# EAGLE design cc (EAGLE 7.5.0)
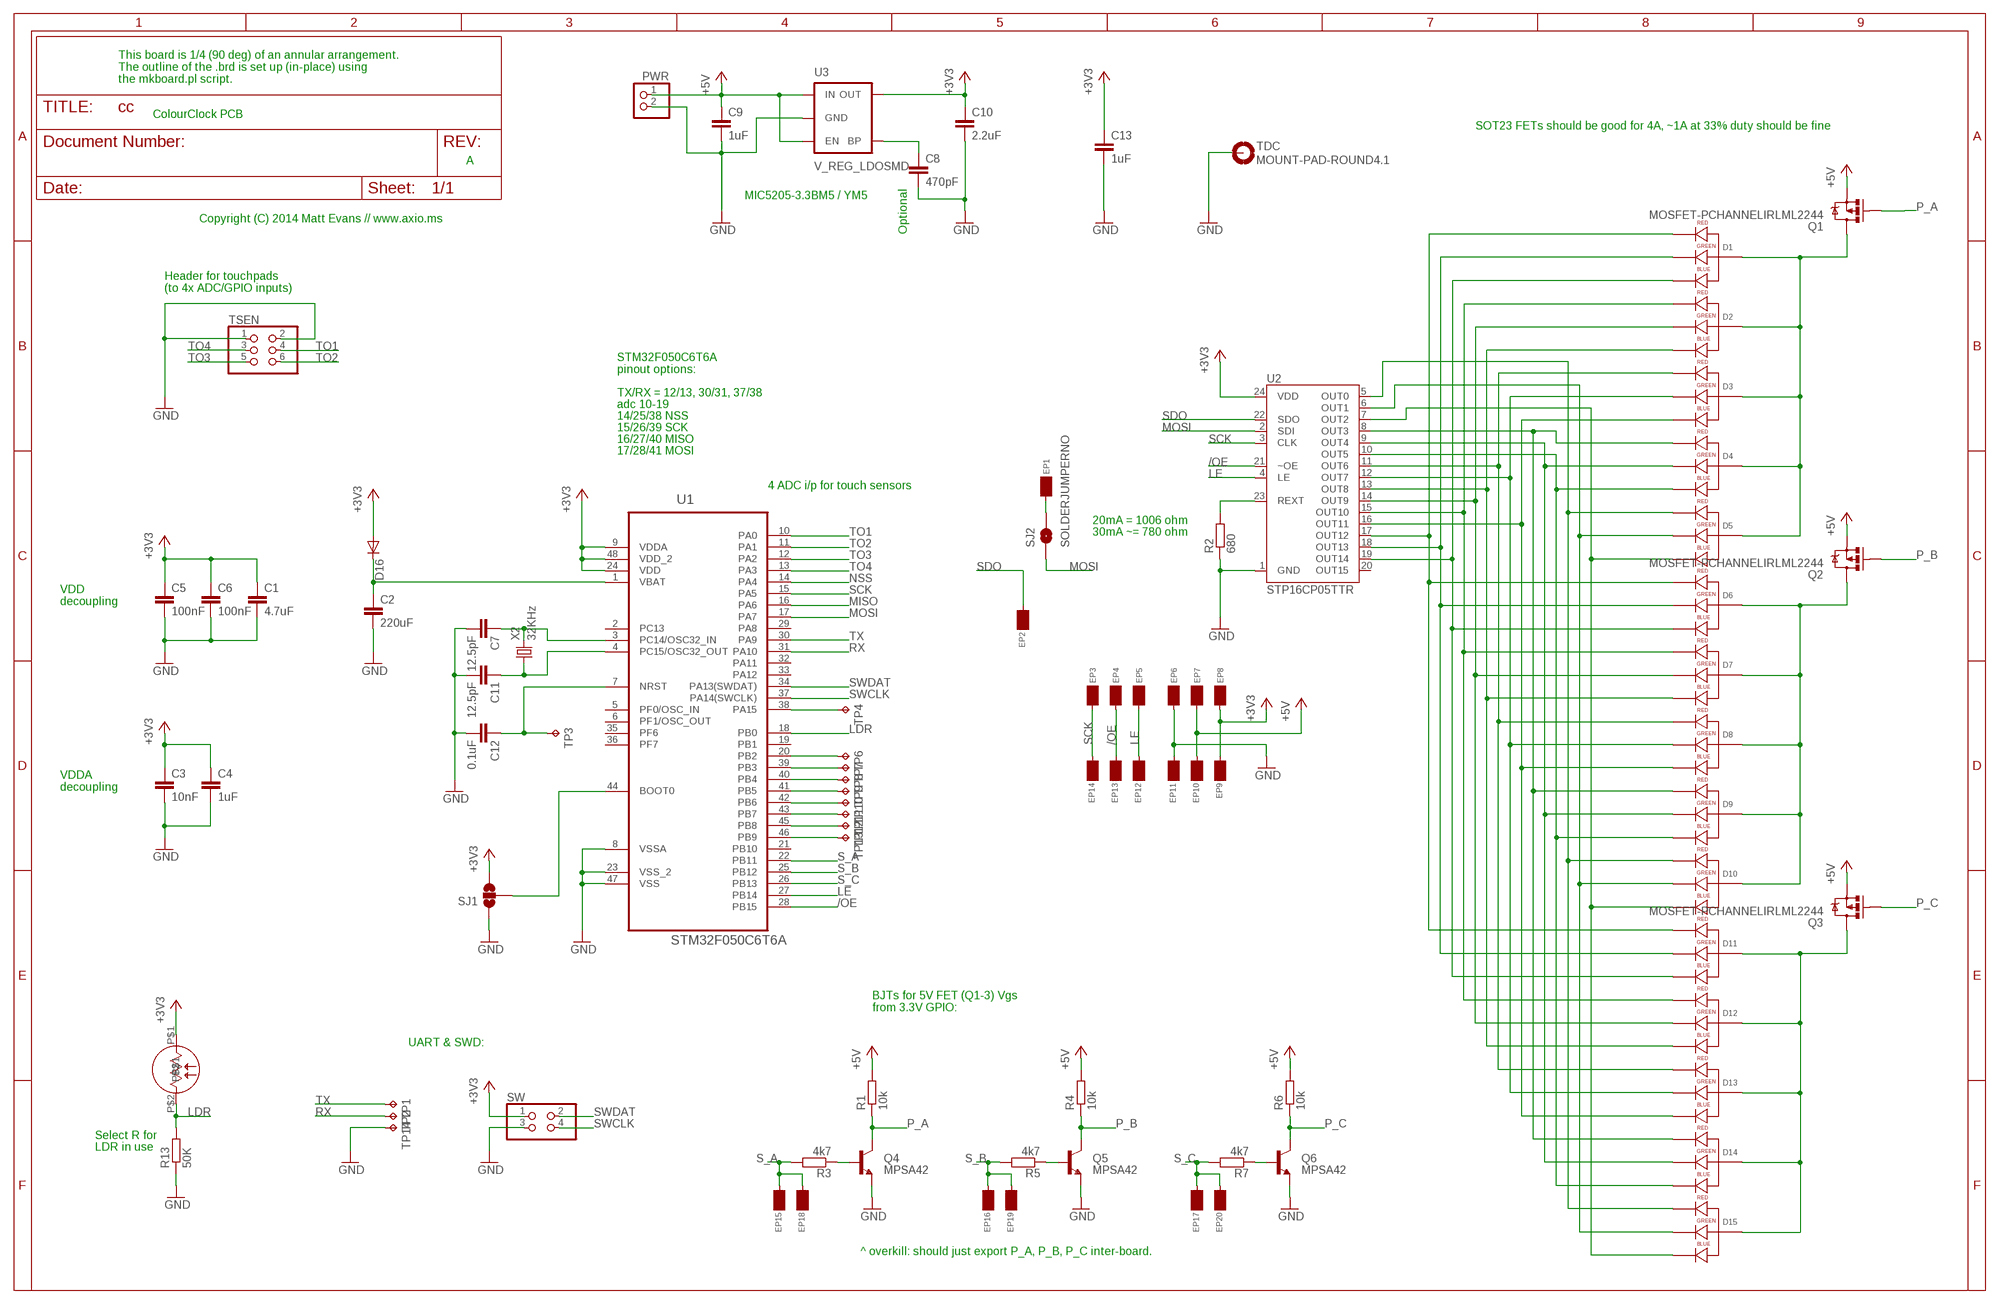
[diagram p0: schematic, sheet 1]

## Parts
C1  4.7uF  C-EUC0603  [C0603]
C2  220uF  C-EUC1210K  [C1210K]
C3  10nF  C-EUC0603  [C0603]
C4  1uF  C-EUC0603  [C0603]
C5  100nF  C-EUC0603  [C0603]
C6  100nF  C-EUC0603  [C0603]
C7  12.5pF  C-EUC1005  [C1005]
C8  470pF  C-EUC0603  [C0603]
C9  1uF  C-EUC0603  [C0603]
C10  2.2uF  C-EUC0603  [C0603]
C11  12.5pF  C-EUC1005  [C1005]
C12  0.1uF  C-EUC1005  [C1005]
C13  1uF  C-EUC0603  [C0603]
D1  LED-RGB-CA-THRUDIFFUSE  [LED-RGB-THRU]
D2  LED-RGB-CA-THRUDIFFUSE  [LED-RGB-THRU]
D3  LED-RGB-CA-THRUDIFFUSE  [LED-RGB-THRU]
D4  LED-RGB-CA-THRUDIFFUSE  [LED-RGB-THRU]
D5  LED-RGB-CA-THRUDIFFUSE  [LED-RGB-THRU]
D6  LED-RGB-CA-THRUDIFFUSE  [LED-RGB-THRU]
D7  LED-RGB-CA-THRUDIFFUSE  [LED-RGB-THRU]
D8  LED-RGB-CA-THRUDIFFUSE  [LED-RGB-THRU]
D9  LED-RGB-CA-THRUDIFFUSE  [LED-RGB-THRU]
D10  LED-RGB-CA-THRUDIFFUSE  [LED-RGB-THRU]
D11  LED-RGB-CA-THRUDIFFUSE  [LED-RGB-THRU]
D12  LED-RGB-CA-THRUDIFFUSE  [LED-RGB-THRU]
D13  LED-RGB-CA-THRUDIFFUSE  [LED-RGB-THRU]
D14  LED-RGB-CA-THRUDIFFUSE  [LED-RGB-THRU]
D15  LED-RGB-CA-THRUDIFFUSE  [LED-RGB-THRU]
D16  DIODESOD  [SOD-323]
EP1  EDGEPAD  [EDGEPAD]
EP2  EDGEPAD  [EDGEPAD]
EP3  EDGEPAD  [EDGEPAD]
EP4  EDGEPAD  [EDGEPAD]
EP5  EDGEPAD  [EDGEPAD]
EP6  EDGEPAD  [EDGEPAD]
EP7  EDGEPAD  [EDGEPAD]
EP8  EDGEPAD  [EDGEPAD]
EP9  EDGEPAD  [EDGEPAD]
EP10  EDGEPAD  [EDGEPAD]
EP11  EDGEPAD  [EDGEPAD]
EP12  EDGEPAD  [EDGEPAD]
EP13  EDGEPAD  [EDGEPAD]
EP14  EDGEPAD  [EDGEPAD]
EP15  EDGEPAD  [EDGEPAD]
EP16  EDGEPAD  [EDGEPAD]
EP17  EDGEPAD  [EDGEPAD]
EP18  EDGEPAD  [EDGEPAD]
EP19  EDGEPAD  [EDGEPAD]
EP20  EDGEPAD  [EDGEPAD]
LDR  VT935G  [VT935G]
PWR  PINHD-1X22MM  [1X02-2MM]
Q1  MOSFET-PCHANNELIRLML2244  [SOT23-3]
Q2  MOSFET-PCHANNELIRLML2244  [SOT23-3]
Q3  MOSFET-PCHANNELIRLML2244  [SOT23-3]
Q4  MPSA42  TRANSISTOR_NPNSOT23-3  [SOT23-3]
Q5  MPSA42  TRANSISTOR_NPNSOT23-3  [SOT23-3]
Q6  MPSA42  TRANSISTOR_NPNSOT23-3  [SOT23-3]
R1  10k  R-EU_R0603  [R0603]
R2  680  R-EU_R0603  [R0603]
R3  4k7  R-EU_R0603  [R0603]
R4  10k  R-EU_R0603  [R0603]
R5  4k7  R-EU_R0603  [R0603]
R6  10k  R-EU_R0603  [R0603]
R7  4k7  R-EU_R0603  [R0603]
R13  50K  R-EU_R0603  [R0603]
SJ1  SOLDERJUMPER_2WAYS  [SJ_3]
SJ2  SOLDERJUMPERNO  [SJ_2S-NO]
SW  PINHD-2X22MM  [2X02-2MM]
TDC  MOUNT-PAD-ROUND4.1  [4,1-PAD]
TP1  TPTP06R  [TP06R]
TP2  TPTP06R  [TP06R]
TP3  TPTP06R  [TP06R]
TP4  TPTP06R  [TP06R]
TP6  TPTP06R  [TP06R]
TP7  TPTP06R  [TP06R]
TP8  TPTP06R  [TP06R]
TP9  TPTP06R  [TP06R]
TP10  TPTP06R  [TP06R]
TP11  TPTP06R  [TP06R]
TP12  TPTP06R  [TP06R]
TP13  TPTP06R  [TP06R]
TP14  TPTP06R  [TP06R]
TSEN  PINHD-2X32MM  [2X03-2MM]
U1  STM32F050C6T6A  [QFP50P900X900X160-48N]
U2  STP16CP05TTR  [TSSOP24]
U3  V_REG_LDOSMD  [SOT23-5]
X2  32KHz  CRYTALTC26V  [TC26V]

## Nets
+3V3: C1.1 C3.1 C4.1 C5.1 C6.1 C10.1 C13.1 D16.2(A) EP8.1(P) EP9.1(P) LDR.P$1 SJ1.3 SW.1 U1.9(VDDA) U1.24(VDD) U1.48(VDD_2) U2.24(VDD) U3.5(OUT)
+5V: C9.1 EP7.1(P) EP10.1(P) PWR.1 Q1.2(S) Q2.2(S) Q3.2(S) R1.2 R4.2 R6.2 U3.1(IN) U3.3(EN)
/OE: EP4.1(P) EP13.1(P) U1.28(PB15) U2.21(~OE)
GND: C1.2 C2.2 C3.2 C4.2 C5.2 C6.2 C7.2 C8.2 C9.2 C10.2 C11.2 C12.2 C13.2 EP6.1(P) EP11.1(P) PWR.2 Q4.2(E) Q5.2(E) Q6.2(E) R2.1 R13.1 SJ1.1 SW.3 TDC.B4,1(MOUNT) TP14.TP TSEN.1 TSEN.2 U1.8(VSSA) U1.23(VSS_2) U1.47(VSS) U2.1(GND) U3.2(GND)
LDR: LDR.P$2 R13.2 U1.18(PB0)
LE: EP5.1(P) EP12.1(P) U1.27(PB14) U2.4(LE)
MISO: U1.16(PA6)
MOSI: SJ2.1 U1.17(PA7) U2.2(SDI)
N$1: D1.1(RED_CATHODE) D6.1(RED_CATHODE) D11.1(RED_CATHODE) U2.17(OUT12)
N$2: D1.3(GREEN_CATHODE) D6.3(GREEN_CATHODE) D11.3(GREEN_CATHODE) U2.18(OUT13)
N$3: D1.4(BLUE_CATHODE) D6.4(BLUE_CATHODE) D11.4(BLUE_CATHODE) U2.19(OUT14)
N$4: D2.1(RED_CATHODE) D7.1(RED_CATHODE) D12.1(RED_CATHODE) U2.15(OUT10)
N$5: D2.3(GREEN_CATHODE) D7.3(GREEN_CATHODE) D12.3(GREEN_CATHODE) U2.14(OUT9)
N$6: D2.4(BLUE_CATHODE) D7.4(BLUE_CATHODE) D12.4(BLUE_CATHODE) U2.13(OUT8)
N$7: D3.1(RED_CATHODE) D8.1(RED_CATHODE) D13.1(RED_CATHODE) U2.11(OUT6)
N$8: D3.3(GREEN_CATHODE) D8.3(GREEN_CATHODE) D13.3(GREEN_CATHODE) U2.12(OUT7)
N$9: D3.4(BLUE_CATHODE) D8.4(BLUE_CATHODE) D13.4(BLUE_CATHODE) U2.16(OUT11)
N$10: D4.1(RED_CATHODE) D9.1(RED_CATHODE) D14.1(RED_CATHODE) U2.8(OUT3)
N$11: D4.3(GREEN_CATHODE) D9.3(GREEN_CATHODE) D14.3(GREEN_CATHODE) U2.9(OUT4)
N$12: D4.4(BLUE_CATHODE) D9.4(BLUE_CATHODE) D14.4(BLUE_CATHODE) U2.10(OUT5)
N$13: D5.1(RED_CATHODE) D10.1(RED_CATHODE) D15.1(RED_CATHODE) U2.5(OUT0)
N$14: D5.3(GREEN_CATHODE) D10.3(GREEN_CATHODE) D15.3(GREEN_CATHODE) U2.6(OUT1)
N$15: D5.4(BLUE_CATHODE) D10.4(BLUE_CATHODE) D15.4(BLUE_CATHODE) U2.7(OUT2)
N$16: C7.1 U1.3(PC14/OSC32_IN) X2.2
N$17: C11.1 U1.4(PC15/OSC32_OUT) X2.1
N$18: R2.2 U2.23(REXT)
N$19: C2.1 D16.1(C) U1.1(VBAT)
N$20: TP8.TP U1.40(PB4)
N$21: TP7.TP U1.39(PB3)
N$22: EP1.1(P) SJ2.2
N$23: TP6.TP U1.20(PB2)
N$24: Q5.1(B) R5.1
N$25: C12.1 TP3.TP U1.7(NRST)
N$26: Q4.1(B) R3.1
N$27: D11.2(ANODE) D12.2(ANODE) D13.2(ANODE) D14.2(ANODE) D15.2(ANODE) Q3.3(D)
N$28: D6.2(ANODE) D7.2(ANODE) D8.2(ANODE) D9.2(ANODE) D10.2(ANODE) Q2.3(D)
N$29: D1.2(ANODE) D2.2(ANODE) D3.2(ANODE) D4.2(ANODE) D5.2(ANODE) Q1.3(D)
N$30: C8.1 U3.4(BP)
N$31: TP4.TP U1.38(PA15)
N$33: SJ1.2 U1.44(BOOT0)
N$34: Q6.1(B) R7.1
N$40: TP9.TP U1.41(PB5)
N$41: TP10.TP U1.42(PB6)
N$42: TP11.TP U1.43(PB7)
N$43: TP12.TP U1.45(PB8)
N$44: TP13.TP U1.46(PB9)
NSS: U1.14(PA4)
P_A: Q1.1(G) Q4.3(C) R1.1
P_B: Q2.1(G) Q5.3(C) R4.1
P_C: Q3.1(G) Q6.3(C) R6.1
RX: TP2.TP U1.31(PA10)
S_A: EP15.1(P) EP18.1(P) R3.2 U1.22(PB11)
S_B: EP16.1(P) EP19.1(P) R5.2 U1.25(PB12)
S_C: EP17.1(P) EP20.1(P) R7.2 U1.26(PB13)
SCK: EP3.1(P) EP14.1(P) U1.15(PA5) U2.3(CLK)
SDO: EP2.1(P) U2.22(SDO)
SWCLK: SW.4 U1.37(PA14(SWCLK))
SWDAT: SW.2 U1.34(PA13(SWDAT))
TO1: TSEN.4 U1.10(PA0)
TO2: TSEN.6 U1.11(PA1)
TO3: TSEN.5 U1.12(PA2)
TO4: TSEN.3 U1.13(PA3)
TX: TP1.TP U1.30(PA9)
Unconnected: U1.2(PC13) U1.5(PF0/OSC_IN) U1.6(PF1/OSC_OUT) U1.19(PB1) U1.21(PB10) U1.29(PA8) U1.32(PA11) U1.33(PA12) U1.35(PF6) U1.36(PF7) U2.20(OUT15)

## Notes on the sheet
- This board is 1/4 (90 deg) of an annular arrangement.
  The outline of the .brd is set up (in-place) using
  the mkboard.pl script.
- ColourClock PCB
- SOT23 FETs should be good for 4A, ~1A at 33% duty should be fine
- A
- MIC5205-3.3BM5 / YM5
- Copyright (C) 2014 Matt Evans // www.axio.ms
- Optional
- Header for touchpads
  (to 4x ADC/GPIO inputs)
- STM32F050C6T6A
  pinout options:
- TX/RX = 12/13, 30/31, 37/38
- adc 10-19
- 14/25/38 NSS
- 15/26/39 SCK
- 16/27/40 MISO
- 17/28/41 MOSI
- 4 ADC i/p for touch sensors
- 20mA = 1006 ohm
- 30mA ~= 780 ohm
- VDD
  decoupling
- VDDA
  decoupling
- BJTs for 5V FET (Q1-3) Vgs
  from 3.3V GPIO:
- UART & SWD:
- Select R for
- LDR in use
- ^ overkill: should just export P_A, P_B, P_C inter-board.

## Library data of the parts
C1-C13 = rcl:C-EU: CAPACITOR, European symbol
D1-D15 = SparkFun-LED:LED-RGB-CA-THRU: RGB Through-hole common anode SparkFun store front COM-10821 (diffuse) COM-10820 (clear); PROD_ID: DIO-10632
D16 = SparkFun-DiscreteSemi:DIODE: Diode These are standard reverse protection diodes and small signal diodes. SMA package can handle up to about 1A. SOD-323 can handle about 200mA. What the SOD-323 package when ordering, there are some mfgs out there that are 5-pin packages.; PROD_ID: DIO-09646
EP1-EP20 = matt:EDGEPAD: Board edge pad
LDR = matt:VT935G: VT935G LDR Light-dependent resistor 10Mohm dark, 48-118Kohm at 10 Lux
PWR = matt:PINHD-1X2: PIN HEADER
Q1-Q3 = SparkFun-DiscreteSemi:MOSFET-PCHANNEL: Generic PMOSFET; PROD_ID: TRANS-11153
Q4-Q6 = SparkFun-DiscreteSemi:TRANSISTOR_NPN: Generic NPN BJT MMBT2222A - TRANS-08049 (SOT-23, 1A 40V) MPSA42 - TRANS-09116 (SOT-23, 500mA 300V) MMBT5088LT1G - TRANS-11160 (SOT-23, 50 mA 30V)
R1 R3-R7 R13 = rcl:R-EU_: RESISTOR, European symbol
R2 = resistor:R-EU_: RESISTOR, European symbol
SJ1 = SparkFun-Passives:SOLDERJUMPER_2WAY: Solder Jumper 2 way solder jumper
SJ2 = SparkFun-Passives:SOLDERJUMPER: Solder Jumper Standard SMD solder jumper. Used to automate production. Two varients : Normally Open and Normally Closed are the same, but have different paste layers. NC will have a large amount of paste and should jumper during reflow.
SW = matt:PINHD-2X2: PIN HEADER
TDC = holes:MOUNT-PAD-ROUND: MOUNTING PAD, round
TP1-TP4 TP6-TP14 = testpad:TP: Test pad
TSEN = matt:PINHD-2X3: PIN HEADER
U1 = e14-stm32f050:STM32F050C6T6A: MCU, 32BIT, ARM CORTEX-M0, 48LQFP; MPN: STM32F050C6T6A; OC_FARNELL: 2115059; OC_NEWARK: 90T0645; PACKAGE: 48LQFP; SUPPLIER: STMicroelectronics
U2 = matt:STP16CP05: 16-pin constant current sink shift register LED driver
U3 = SparkFun-PowerIC:V_REG_LDO: Voltage Regulator LDO Standard 150mA LDO voltage regulator in SOT-23 layout. Micrel part MIC5205. BP (by-pass) pin is used to lower output noise with 470pF cap.
X2 = crystal:CRYTAL: CRYSTAL

## Board
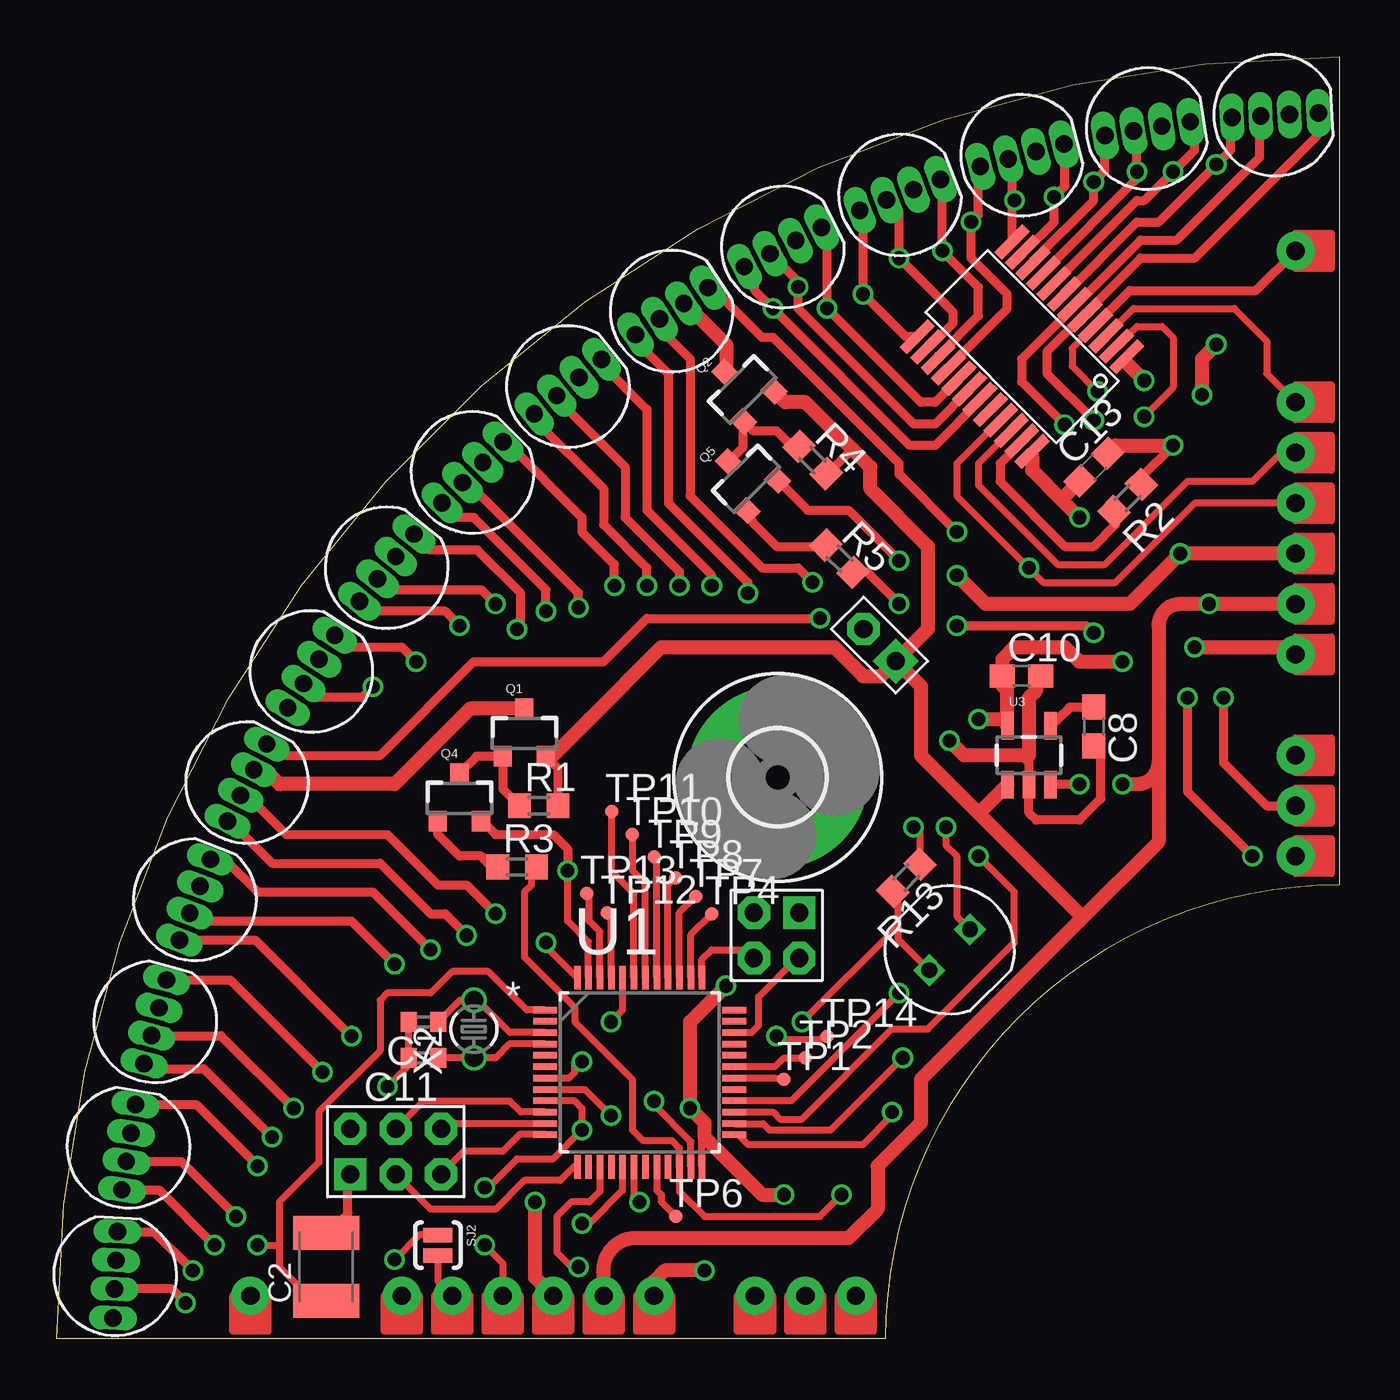
[diagram p1: board, top side]
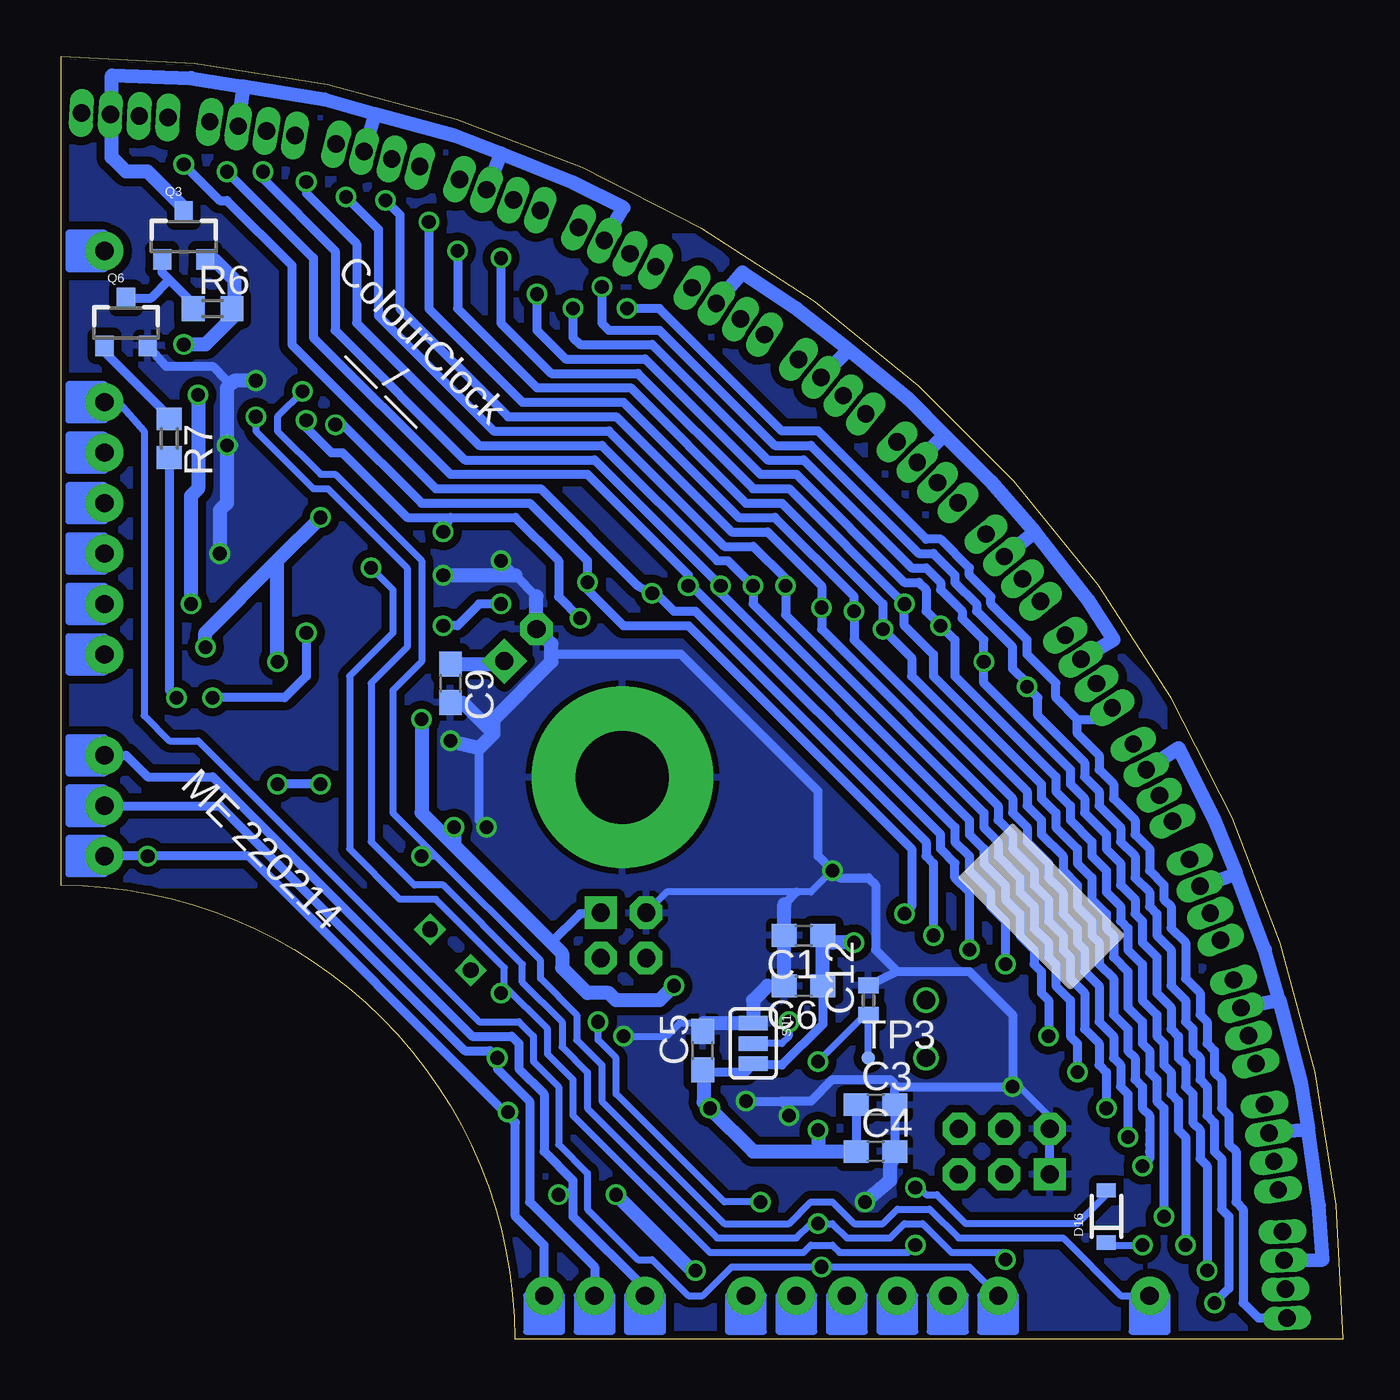
[diagram p2: board, bottom side, seen from below]

Size 56.5 x 56.5 mm. Coordinates in mm from the lower left corner, seen from the top.
Outline: 0,0 0.31,5.91 1.24,11.75 2.77,17.46 4.88,22.98 7.57,28.25 10.79,33.21 14.51,37.81 18.69,41.99 23.29,45.71 28.25,48.93 33.52,51.62 39.04,53.73 44.75,55.27 50.59,56.19 56.5,56.5 56.5,20 55.52,19.98 54.54,19.9 53.56,19.78 52.6,19.62 51.64,19.4 50.69,19.14 49.76,18.83 48.85,18.48 47.95,18.08 47.07,17.64 46.22,17.16 45.39,16.63 44.59,16.06 43.81,15.46 43.07,14.82 42.36,14.14 41.68,13.43 41.04,12.69 40.44,11.91 39.87,11.11 39.34,10.28 38.86,9.43 38.42,8.55 38.02,7.65 37.67,6.74 37.36,5.81 37.1,4.86 36.88,3.9 36.72,2.94 36.6,1.96 36.52,0.98 36.5,0 0,0
Copper layers (1*2*15*16): Top 0.035mm / dielectric 0.2mm / layer 2 0.0175mm / dielectric 1.1mm / layer 15 0.0175mm / dielectric 0.2mm / Bottom 0.035mm
Design rules "SeeedStudio_DRU_no_angle_20130527 *": minimum track width 6mil, minimum drill 12mil, track to track 6mil, track to pad 6mil, pad to pad 6mil, via to via 6mil, smd to smd 0mil, copper to edge 10mil, drill to drill 10mil, minimum pad ring 6mil, minimum via ring 6mil, stop-mask expansion 2mil, vias tented up to drill 25mil, thermal gap 10mil

### Footprints (pad centres in the part's own frame; a part is rotated, then mirrored left to right if it is on the bottom)
C0603 = smd 1.1 x 1: 1 -0.85,0; 2 0.85,0
C1210K = smd 1.5 x 2.9: 1 -1.5,0; 2 1.5,0
C1005 = smd 0.7 x 0.9: 1 -0.65,0; 2 0.65,0
LED-RGB-THRU = drill 0.762 pad 0.889 long: 1 1.905,0; 2 0.635,0; 3 -0.635,0; 4 -1.905,0
SOD-323 = smd 0.63 x 0.83: 1 -1.15,0; 2 1.15,0
EDGEPAD = drill 0.8 pad 1.676: 1 0,0
VT935G = drill 0.7 square: P$1 -1.27,0; P$2 1.27,0
1X02-2MM = drill 0.8 pad 1.422 square: 1 -1,0 | drill 0.8 pad 1.422 octagon: 2 1,0
SOT23-3 = smd 0.8 x 0.9: 1 -0.95,-1; 2 0.95,-1; 3 0,1.1
R0603 = smd 1 x 1.1: 1 -0.85,0; 2 0.85,0
SJ_3 = smd 0.635 x 1.27: 1 -0.889,0; 2 0,0; 3 0.889,0
SJ_2S-NO = smd 0.635 x 1.27: 1 -0.45,0; 2 0.45,0
2X02-2MM = drill 0.8 pad 1.422 square: 1 -1,1 | drill 0.8 pad 1.422 octagon: 2 1,1; 3 -1,-1; 4 1,-1
4,1-PAD = drill 4.1 pad 8: B4,1 0,0
TP06R = smd 0.6 x 0.6: TP 0,0
2X03-2MM = drill 0.8 pad 1.422 square: 1 -1,1 | drill 0.8 pad 1.422 octagon: 2 1,1; 3 -1,-1; 4 1,-1; 5 -1,-3; 6 1,-3
QFP50P900X900X160-48N = smd 1.041 x 0.279: 1 -4.166,2.743; 2 -4.166,2.261; 3 -4.166,1.753; 4 -4.166,1.245; 5 -4.166,0.762; 6 -4.166,0.254; 7 -4.166,-0.254; 8 -4.166,-0.762; 9 -4.166,-1.245; 10 -4.166,-1.753; 11 -4.166,-2.261; 12 -4.166,-2.743; 25 4.166,-2.743; 26 4.166,-2.261; 27 4.166,-1.753; 28 4.166,-1.245; 29 4.166,-0.762; 30 4.166,-0.254; 31 4.166,0.254; 32 4.166,0.762; 33 4.166,1.245; 34 4.166,1.753; 35 4.166,2.261; 36 4.166,2.743 | smd 0.279 x 1.041: 13 -2.743,-4.166; 14 -2.261,-4.166; 15 -1.753,-4.166; 16 -1.245,-4.166; 17 -0.762,-4.166; 18 -0.254,-4.166; 19 0.254,-4.166; 20 0.762,-4.166; 21 1.245,-4.166; 22 1.753,-4.166; 23 2.261,-4.166; 24 2.743,-4.166; 37 2.743,4.166; 38 2.261,4.166; 39 1.753,4.166; 40 1.245,4.166; 41 0.762,4.166; 42 0.254,4.166; 43 -0.254,4.166; 44 -0.762,4.166; 45 -1.245,4.166; 46 -1.753,4.166; 47 -2.261,4.166; 48 -2.743,4.166
TSSOP24 = smd 0.45 x 1.75: 1 -3.65,-2.9; 2 -3,-2.9; 3 -2.35,-2.9; 4 -1.7,-2.9; 5 -1.05,-2.9; 6 -0.4,-2.9; 7 0.25,-2.9; 8 0.9,-2.9; 9 1.55,-2.9; 10 2.2,-2.9; 11 2.85,-2.9; 12 3.5,-2.9; 13 3.5,3; 14 2.85,3; 15 2.2,3; 16 1.55,3; 17 0.9,3; 18 0.25,3; 19 -0.4,3; 20 -1.05,3; 21 -1.7,3; 22 -2.35,3; 23 -3,3; 24 -3.65,3
SOT23-5 = smd 0.55 x 1.2: 1 -0.95,-1.3; 2 0,-1.3; 3 0.95,-1.3; 4 0.95,1.3; 5 -0.95,1.3
TC26V = drill 0.813: 1 -1.27,0; 2 1.27,0

### Placement (x,y rotation side)
C1  23.77,17.78 180 bottom
C2  11.87,3.17 90 top
C3  20.6,10.32 0 bottom
C4  20.6,8.26 0 bottom
C5  28.22,12.7 90 bottom
C6  23.77,15.56 180 bottom
C7  16.15,13.97 180 top
C8  45.68,26.99 270 top
C9  39.33,28.89 270 bottom
C10  42.51,29.21 0 top
C11  16.15,12.38 180 top
C12  20.91,14.92 90 bottom
C13  45.68,38.42 45 top
D1  2.57,2.83 87 top
D2  3.16,8.45 81 top
D3  4.34,13.98 75 top
D4  6.09,19.35 69 top
D5  8.39,24.52 63 top
D6  11.21,29.41 57 top
D7  14.53,33.98 51 top
D8  18.32,38.18 45 top
D9  22.52,41.97 39 top
D10  27.09,45.29 33 top
D11  31.98,48.11 27 top
D12  37.15,50.41 21 top
D13  42.52,52.16 15 top
D14  48.05,53.34 9 top
D15  53.67,53.93 3 top
D16  10.44,5.4 90 bottom
EP1  17.42,1.91 270 top
EP2  54.57,39.05 0 top
EP3  15.2,1.91 270 top
EP4  19.64,1.91 270 top
EP5  54.57,47.94 0 top
EP6  21.87,1.91 270 top
EP7  24.09,1.91 270 top
EP8  26.31,1.91 270 top
EP9  54.57,30.16 0 top
EP10  54.57,32.38 0 top
EP11  54.57,34.61 0 top
EP12  8.53,1.91 270 top
EP13  54.57,36.83 0 top
EP14  54.57,41.27 0 top
EP15  30.76,1.91 270 top
EP16  35.2,1.91 270 top
EP17  54.57,23.5 0 top
EP18  54.57,25.72 0 top
EP19  54.57,21.27 0 top
EP20  32.98,1.91 270 top
LDR  39.33,17.14 225 top
PWR  36.25,30.57 135 top
Q1  20.6,26.67 0 top
Q2  30.22,41.82 45 top
Q3  51.08,48.58 0 bottom
Q4  17.74,23.81 0 top
Q5  30.37,37.88 45 top
Q6  53.62,44.77 0 bottom
R1  21.23,23.5 0 top
R2  47.17,37.05 225 top
R3  20.28,20.8 0 top
R4  33.3,38.73 315 top
R5  34.47,34.38 315 top
R6  49.81,45.4 0 bottom
R7  51.71,39.69 270 bottom
R13  37.42,20.32 225 top
SJ1  26,13.02 270 bottom
SJ2  16.79,4.13 270 top
SW  31.71,17.78 270 top
TDC  31.75,24.75 0 top
TP1  32.03,11.43 0 top
TP2  32.98,12.38 0 top
TP3  20.91,12.38 0 bottom
TP4  28.85,18.73 0 top
TP6  27.27,5.4 0 top
TP7  28.15,19.5 0 top
TP8  27.27,20.32 0 top
TP9  26.33,21.23 0 top
TP10  25.36,22.23 0 top
TP11  24.45,23.24 0 top
TP12  24.24,18.77 0 top
TP13  23.35,19.64 0 top
TP14  33.93,13.34 0 top
TSEN  13.93,8.26 90 top
U1  25.68,11.75 0 top
U2  42.51,43.81 135 top
U3  42.82,25.72 0 top
X2  18.38,13.65 90 top

### Tracks (layer width: path | path; a pad name or v marks a point on that pad's centre or on a via)
+3V3  (via drill 0.6)
  Top 0.305: U1.48 21.51,17.35 v21.55,17.46 | U1.9 22.8,10.5 23.14,10.16 v23.14,9.21 21.87,7.94 20.28,7.94 19.01,6.67 v18.85,6.67 | U1.24 28.42,8.78 28.54,8.89 | v39.17,22.54 39.17,21.75 39.65,21.27 39.65,18.62 LDR.P$1
  Top 0.406: C13.1 44.69,37.82 | U2.24 42.97,38.91 | 41.59,27.3 U3.5 | LDR.P$1 40.23,18.15
  Top 0.61: v50.12,30.48 54.25,30.48 EP9.1 | v46.95,29.84 45.05,29.84 44.41,30.48 42.19,30.48 41.66,29.95 C10.1 41.66,28.79 41.87,28.57 U3.5 | 41.59,27.3 v40.6,27.3 | v28.54,3.02 26.79,3.02 26.31,2.54 EP8.1 | v32.03,6.35 31.07,6.35 28.54,8.89 28.54,9.53 v27.9,10.16 27.9,13.97 v29.49,15.56 | 42.97,38.91 42.97,38.27 44.25,36.99 | 44.25,36.99 v45.05,36.2 | C13.1 44.25,36.99
  Bottom 0.305: 32.76,18.73 SW.1 | 25.93,12.06 SJ1.3 | v18.85,6.67 18.85,6.83 18.38,6.35 17.9,6.35 16.63,5.08 11.71,5.08 10.24,6.55 D16.2 | 22.5,17.46 22.92,17.36 C1.1 | 27.92,11.75 28.11,11.75 C5.1
  Bottom 0.406: SJ1.3 26.31,11.75 27.92,11.75 28.18,11.49 | C6.1 22.92,13.87 24.73,12.06 25.93,12.06 | 32.76,18.73 33.61,18.73 34.88,17.46 | C3.1 C4.1
  Bottom 0.61: v45.05,36.2 46.95,34.29 | v46.95,29.84 46.95,34.29 | v40.6,27.3 40.6,23.18 39.17,21.75 | v32.03,6.35 28.69,3.02 v28.54,3.02 | v29.49,15.56 30.12,14.92 32.03,14.92 32.34,15.24 33.3,15.24 34.41,16.35 34.41,16.99 34.88,17.46 39.17,21.75 | v39.17,22.54 39.17,21.75 | v50.12,30.48 50.12,31.11 46.95,34.29 | v21.55,17.46 22.5,17.46 | C6.1 22.92,17.36 | 28.18,11.49 28.18,10.44 v27.9,10.16 26,8.26 23.14,8.26 | 23.14,8.26 C4.1 | v23.14,9.21 23.14,8.26
+5V  (via drill 0.6)
  Top 0.305: Q1.2 21.82,25.67
  Top 0.406: U3.3 43.8,24.45 v45.05,24.45 | R4.2 33.97,38.13 35.04,39.21 | R1.2 22.08,25.14 Q1.2
  Top 0.61: v51.08,43.81 50.44,43.18 v50.44,41.59 | EP10.1 v50.76,32.38 49.49,32.38 arc90 48.54,31.43 48.54,25.4 | PWR.1 36.3,29.21 35.52,29.21 34.25,30.48 26.63,30.48 23.45,27.3 21.82,25.67 | EP7.1 24.09,2.86 arc-90 25.36,4.45 34.88,4.45 36.16,5.71 36.16,7.62 38.06,9.53 38.06,11.43 45.05,18.41 | 45.05,18.41 48.54,21.91 48.54,25.4 | PWR.1 38.38,31.29 38.38,34.92 35.84,37.47 35.84,38.42 35.04,39.21 32.98,41.27 32.1,41.27 Q2.2 | PWR.1 38.06,28.76 38.06,25.72 40.6,23.18 | v46.95,24.45 47.59,24.45 arc90 48.54,25.4 | 40.6,23.18 45.05,18.73 45.05,18.41 | U3.1 40.63,23.18 40.6,23.18
  Bottom 0.406: Q3.2 49.76,47.58 | 48.85,45.51 R6.2 48.96,44.98 | v45.05,24.45 v46.95,24.45
  Bottom 0.61: 49.76,47.58 48.85,46.67 48.85,45.51 | 48.96,44.98 50.12,43.81 v51.08,43.81 | v50.44,41.59 50.44,37.47 50.76,37.15 v50.76,32.38 | C9.1 37.15,29.74 PWR.1
/OE  (via drill 0.6)
  Top 0.305: EP13.1 50.12,36.83 46.63,33.34 43.46,33.34 v42.82,33.97 39.65,37.15 39.65,38.58 41.56,40.49 | v18.85,4.13 19.64,3.33 EP4.1 | U1.28 32.37,10.5 v37.11,15.24
  Top 0.406: U2.21 41.56,40.49
  Bottom 0.305: v18.85,4.13 19.17,3.81 22.18,3.81 22.5,4.13 23.45,4.13 23.77,3.81 27.9,3.81 33.93,9.84 33.93,11.43 35.04,12.54 35.04,13.65 36.95,15.56 | v42.82,33.97 41.87,33.02 41.87,31.11 43.77,29.21 43.77,21.59 41.55,19.37 39.97,19.37 36.95,16.35 36.95,15.56 | v37.11,15.24 36.95,15.4 36.95,15.56
GND  (via drill 0.6)
  Top 0.305: C7.2 C11.2 15.52,12.06 v14.56,11.11 | U1.47 23.42,17.5 22.5,18.41 v22.5,20.64 | U1.23 27.94,8.69 26.31,10.32 v26.31,10.48 | U1.8 23.27,10.99 v24.41,9.84 | C2.2 12.82,5.56 | TP14.TP 33.77,13.34 33.61,13.18 31.71,13.18 v31.71,13.34 | v37.74,22.54 38.03,22.26 R13.1 | Q4.2 18.74,22.81
  Top 0.406: U2.1 47.14,42.99 | R2.1 47.78,37.97 v49.17,39.37 | 46.63,39.37 C13.2 | v37.11,34.29 34.88,36.51 33.08,36.51 Q5.2 | 42.51,25.72 42.66,25.56 | 42.66,25.56 42.82,25.4 U3.2 42.82,23.18 43.14,22.86 45.05,22.86 46,23.81 46,25.82 arc90 C8.2 | 42.82,25.72 42.66,25.56 | v22.5,20.64 22.5,21.59 21.87,22.23 19.33,22.23 18.74,22.81 | 12.82,5.56 12.82,7.14 TSEN.1
  Top 0.61: 47.14,42.99 v47.9,42.23 | EP11.1 v49.49,34.61 47.27,32.38 40.92,32.38 v39.65,33.66 | 46.63,39.37 v49.17,39.37 | 42.82,25.72 42.82,28.26 43.14,28.57 43.14,29 C10.2 | 42.51,25.72 39.97,25.72 v39.33,26.35 | EP6.1 21.07,2.7 v21.07,6.03
  Bottom 0.305: v22.5,20.64 23.45,19.68 24.09,19.68 29.8,19.68 SW.3 | v14.56,11.11 14.25,11.11 12.93,9.79 TSEN.2 | v31.71,13.34 29.8,13.34 29.23,13.91 28.18,13.91 28.18,13.59 C5.2 | 19.64,7.94 19.64,8.15 C4.2 | 24.71,10.48 24.73,10.46 | 19.75,11.01 19.64,11.11
  Bottom 0.406: 49.17,41.91 49.17,42.23 49.81,42.86 51.86,42.86 Q6.2 | v49.17,39.37 48.85,39.37 49.17,39.69 | 35.54,32.72 36.47,33.66 v37.11,34.29 | C6.2 25.36,15.56 | 19.64,16.19 20.6,17.14 20.6,20 20.91,20.32 22.18,20.32 v22.5,20.64 23.14,21.27 23.14,24.13 29.17,30.16 34.88,30.16 | 19.64,16.19 16.47,16.19 14.56,14.29 v14.56,11.11 19.64,11.11 19.96,11.43 22.5,11.43 23.45,10.48 24.71,10.48 | v24.41,9.84 24.41,10.14 24.73,10.46 24.74,10.48 v26.31,10.48 | TSEN.1 TSEN.2 | v37.74,22.54 38.06,22.86 38.06,26.04 | 19.96,7.62 19.64,7.94 | C4.2 C3.2 19.75,11.01 | C12.2 19.64,16.19 | 24.62,19.15 24.09,19.68
  Bottom 0.61: v47.9,42.23 48.85,42.23 49.17,41.91 49.17,39.69 49.17,36.83 49.49,36.51 v49.49,34.61 | 35.54,32.72 PWR.2 34.88,30.62 34.88,30.16 34.88,29.84 37.42,27.3 37.42,26.67 | v39.33,26.35 38.06,26.04 37.42,26.67 | C9.2 38.8,28.04 37.42,26.67 | 25.36,15.56 26,14.92 SJ1.1 28.18,13.91 | v21.07,6.03 19.96,6.99 19.96,7.62 | v39.65,33.66 36.47,33.66 | C6.2 C1.2 24.62,19.15
  pour Bottom (isolate 0.356): 2.5,0.32 2.66,0.16 36.47,0.16 36.47,14.61 41.87,20 56.16,20 56.48,20.32 56.48,53.98 40.28,53.98 34.88,48.58 28.22,48.58 7.9,28.26 7.9,21.59 2.5,16.19
LDR  (via drill 0.6)
  Top 0.305: LDR.P$2 37.07,17.61 37.07,18.1 | U1.18 25.42,6.29 v25.68,6.03 | 37.07,18.1 37.07,19.47 | v32.82,13.97 36.95,18.1 37.07,18.1
  Top 0.406: 37.07,19.47 R13.2
  Bottom 0.305: v32.82,13.97 32.82,13.18 32.03,12.38 32.03,10.79 27.27,6.03 v25.68,6.03
LE  (via drill 0.6)
  Top 0.305: U2.4 44.73,43.66 44.73,42.86 v45.84,41.75 | v40.6,21.27 42.19,19.68 42.19,17.46 38.38,13.65 36.79,13.65 32.82,9.68 31.87,9.68 31.56,9.99 U1.27
  Top 0.406: U2.4 45.76,44.69 47.27,46.2 52.82,46.2 EP5.1
  Bottom 0.305: v45.84,41.75 46.95,40.64 46.95,40.01 45.05,38.1 44.41,38.1 40.6,34.29 40.6,29.84 41.87,28.57 41.87,23.18 39.97,21.27 | 39.97,21.27 35.36,16.67 35.36,15.88 33.77,14.29 33.77,13.18 32.66,12.06 32.66,10.48 27.27,5.08 24.41,5.08 23.45,6.03 22.5,6.03 21.55,5.08 20.28,5.08 19.64,5.71 18.22,5.71 16.95,4.45 12.34,4.45 9.8,1.91 EP12.1 | v40.6,21.27 39.97,21.27
MOSI  (via drill 0.6)
  Top 0.305: 46.72,43.74 47.59,44.61 48.7,44.61 49.17,44.13 49.17,41.91 v47.9,40.64 | U1.17 24.92,6.54 23.45,5.08 v23.14,5.08 | SJ2.1 15.97,4.58 v14.88,3.49
  Top 0.406: U2.2 46.72,43.74
  Bottom 0.305: v47.9,40.64 47.9,40.01 45.36,37.47 44.73,37.47 41.23,33.97 41.23,30.48 42.82,28.89 42.82,21.91 40.92,20 39.65,20 36.16,16.51 36.16,15.72 34.41,13.97 34.41,12.86 33.3,11.75 33.3,10.16 27.58,4.45 24.09,4.45 23.45,5.08 v23.14,5.08 22.5,5.08 21.87,4.45 19.96,4.45 19.33,5.08 18.53,5.08 17.26,3.81 14.88,3.81 v14.88,3.49
N$1  (via drill 0.6)
  Top 0.406: U2.17 38.7,41.27 38.06,41.27 v33.93,45.4 33.93,48.73 D11.1 | D6.1 12.78,30.48 15.2,30.48 v15.84,29.84 | D1.1 4.28,4.73 v5.99,3.02
  Bottom 0.406: v33.93,45.4 33.93,44.13 33.61,43.81 30.44,43.81 25.36,38.73 23.77,38.73 19.01,33.97 18.38,33.97 17.74,33.34 17.74,33.02 16.79,32.07 16.79,31.75 15.84,30.8 v15.84,29.84 15.84,28.89 12.03,25.08 12.03,24.45 11.39,23.81 11.39,23.18 10.44,22.23 10.44,21.59 9.8,20.95 9.8,20 9.17,19.37 9.17,18.73 8.85,18.41 8.85,17.46 8.21,16.83 8.21,15.24 7.58,14.61 7.58,13.65 7.26,13.34 7.26,12.38 6.95,12.06 6.95,11.11 6.63,10.79 6.63,9.53 6.31,9.21 6.31,7.94 5.99,7.62 v5.99,3.02
N$2  (via drill 0.6)
  Top 0.406: U2.18 40.21,41.83 38.7,40.32 37.74,40.32 32.66,45.4 v32.66,46.35 32.66,46.58 D11.3 | v5.67,1.59 5.04,2.22 2.57,2.22 D1.3 | v13.93,28.73 13.45,28.26 11.39,28.26 10.87,28.78 D6.3
  Bottom 0.406: v32.66,46.35 32.66,44.77 32.34,44.45 30.12,44.45 25.04,39.37 23.45,39.37 18.69,34.61 18.06,34.61 17.11,33.66 17.11,33.34 16.15,32.38 16.15,32.07 14.56,30.48 14.56,29.53 13.93,28.89 v13.93,28.73 13.45,28.26 13.45,27.46 11.39,25.4 11.39,24.77 10.76,24.13 10.76,23.5 9.8,22.54 9.8,21.91 9.17,21.27 9.17,20.32 8.53,19.68 8.53,19.05 8.21,18.73 8.21,17.78 7.58,17.14 7.58,15.56 6.95,14.92 6.95,13.97 6.63,13.65 6.63,12.7 6.31,12.38 6.31,11.43 5.99,11.11 5.99,9.84 5.67,9.53 5.67,8.26 5.36,7.94 5.36,5.71 5.04,5.4 5.04,2.22 v5.67,1.59
N$3  (via drill 0.6)
  Top 0.406: U2.19 40.67,41.34 38.7,39.37 37.58,39.37 v31.55,45.4 30.76,46.2 30.76,46.78 D11.4
  Bottom 0.406: 11.71,27.3 11.71,26.67 10.76,25.72 10.76,25.08 10.12,24.45 10.12,23.81 9.17,22.86 9.17,22.23 8.53,21.59 8.53,20.64 7.9,20 7.9,19.37 7.58,19.05 7.58,18.1 6.95,17.46 6.95,15.88 6.31,15.24 6.31,14.29 5.99,13.97 5.99,13.02 5.67,12.7 5.67,11.75 5.36,11.43 5.36,10.16 5.04,9.84 5.04,8.57 4.72,8.26 4.72,6.03 4.41,5.71 4.41,1.59 3.74,0.92 D1.4 | 11.71,27.3 12.66,28.26 12.66,28.89 13.93,30.16 13.93,30.8 15.52,32.38 15.52,32.7 16.47,33.66 16.47,33.97 17.74,35.24 18.38,35.24 23.14,40.01 24.73,40.01 30.12,45.4 v31.55,45.4 31.39,45.24 | 11.71,27.3 10.68,27.3 D6.4
N$4  (via drill 0.6)
  Top 0.406: U2.15 38.83,43.31 40.6,45.09 40.6,46.35 v39.01,47.94 39.01,51.01 D12.1 | 15.93,35.46 D7.1 16.43,34.77 18.53,34.77 20.44,32.86 20.44,31.43 v20.28,31.27 | D2.1 6.14,10.33 v8.85,7.62
  Bottom 0.406: v39.01,47.94 39.01,45.4 35.52,41.91 31.39,41.91 26.31,36.83 24.73,36.83 20.28,32.38 v20.28,31.27 19.01,30 19.01,29.21 13.93,24.13 13.93,23.5 13.29,22.86 13.29,22.23 12.34,21.27 12.34,20.64 11.71,20 11.71,19.05 11.07,18.41 11.07,17.78 10.76,17.46 10.76,16.51 10.12,15.88 10.12,14.29 9.48,13.65 9.48,12.7 9.17,12.38 9.17,11.43 8.85,11.11 8.85,10.16 8.53,9.84 8.53,9.21 8.53,8.57 8.53,8.26 8.54,7.94 v8.85,7.62
N$5  (via drill 0.6)
  Top 0.406: U2.14 38.43,43.71 39.49,44.77 39.49,45.24 v37.11,47.62 37.11,49.63 D12.3 | D7.3 14.6,33.02 18.69,33.02 v19.33,32.38 | D2.3 5.47,7.82 v7.9,5.4
  Bottom 0.406: v37.11,47.62 37.11,44.77 34.88,42.55 31.07,42.55 26,37.47 24.41,37.47 v19.33,32.38 19.33,31.43 18.06,30.16 18.06,29.21 13.29,24.45 13.29,23.81 12.66,23.18 12.66,22.54 11.71,21.59 11.71,20.95 11.07,20.32 11.07,19.37 10.44,18.73 10.44,18.1 10.12,17.78 10.12,16.83 9.48,16.19 9.48,14.61 8.85,13.97 8.85,13.02 8.53,12.7 8.53,11.75 8.21,11.43 8.21,10.48 7.9,10.16 v7.9,5.4
N$6  (via drill 0.6)
  Top 0.406: U2.13 37.39,44.17 v35.52,46.04 35.52,49.58 D12.4 | D2.4 4.51,6.57 v6.95,4.13 | v17.74,31.43 17.11,32.07 13.61,32.07 13.34,32.34 D7.4
  Bottom 0.406: v35.52,46.04 35.52,44.45 34.25,43.18 30.76,43.18 25.68,38.1 24.09,38.1 19.33,33.34 18.69,33.34 18.38,33.02 18.38,32.07 v17.74,31.43 17.11,30.8 17.11,29.21 12.66,24.77 12.66,24.13 12.03,23.5 12.03,22.86 11.07,21.91 11.07,21.27 10.44,20.64 10.44,19.68 9.8,19.05 9.8,18.41 9.48,18.1 9.48,17.14 8.85,16.51 8.85,14.92 8.21,14.29 8.21,13.34 7.9,13.02 7.9,12.06 7.58,11.75 7.58,10.79 7.26,10.48 7.26,9.21 6.95,8.89 v6.95,4.13
N$7  (via drill 0.6)
  Top 0.406: D13.1 44.41,52.61 44.41,50.8 v43.93,50.32 43.93,49.21 42.6,47.88 U2.11 | D8.1 19.8,39.53 23.14,36.2 23.14,35.56 24.57,34.13 v24.57,33.18 | D3.1 7.64,15.82 v11.71,11.75
  Bottom 0.406: v43.93,50.32 42.51,48.9 42.51,45.09 37.42,40.01 32.34,40.01 27.27,34.92 26,34.92 24.57,33.5 v24.57,33.18 24.57,31.91 15.84,23.18 15.84,22.54 15.2,21.91 15.2,21.27 14.25,20.32 14.25,19.68 13.61,19.05 13.61,18.1 12.98,17.46 12.98,16.83 12.66,16.51 12.66,15.56 12.03,14.92 12.03,13.34 11.71,13.02 v11.71,11.75
N$8  (via drill 0.6)
  Top 0.406: D13.3 42.08,51.83 U2.12 42.08,50.06 v42.19,50.16 | D8.3 18.12,37.73 22.98,32.87 v22.98,32.23 | D3.3 7.24,13.36 v10.44,10.16
  Bottom 0.406: v42.19,50.16 41.55,49.53 41.55,45.4 36.79,40.64 32.03,40.64 26.95,35.56 25.36,35.56 22.98,33.18 v22.98,32.23 22.98,31.27 15.2,23.5 15.2,22.86 14.56,22.23 14.56,21.59 13.61,20.64 13.61,20 12.98,19.37 12.98,18.41 12.34,17.78 12.34,17.14 12.03,16.83 12.03,15.88 11.39,15.24 11.39,13.65 10.76,13.02 10.76,12.06 10.44,11.75 v10.44,10.16
N$9  (via drill 0.6)
  Top 0.406: U2.16 39.29,42.82 41.87,45.4 41.87,46.04 40.28,47.62 v40.28,49.21 40.6,49.53 40.6,51.43 D13.4 | 16.97,36.65 D8.4 17.61,36.2 18.38,36.2 21.55,33.02 v21.55,32.07 | D3.4 4.33,12.14 4.56,11.91 6.47,11.91 v9.48,8.89
  Bottom 0.406: v40.28,49.21 40.28,45.4 36.16,41.27 31.71,41.27 26.63,36.2 25.04,36.2 21.55,32.7 v21.55,32.07 21.55,30.8 14.56,23.81 14.56,23.18 13.93,22.54 13.93,21.91 12.98,20.95 12.98,20.32 12.34,19.68 12.34,18.73 11.71,18.1 11.71,17.46 11.39,17.14 11.39,16.19 10.76,15.56 10.76,13.97 10.12,13.34 10.12,12.38 9.8,12.06 9.8,11.11 9.48,10.79 v9.48,8.89
N$10  (via drill 0.6)
  Top 0.406: U2.8 47.59,50.16 47.9,50.16 v49.17,51.44 50.12,52.39 50.12,53.44 D14.1 | D9.1 24,42.95 26,40.96 26,36.51 28.85,33.66 v28.85,33.18 | D4.1 7.41,21.13 8.85,19.68 13.93,19.68 v16.47,17.14
  Bottom 0.406: v49.17,51.44 45.36,47.62 45.36,44.13 39.33,38.1 33.3,38.1 28.85,33.66 v28.85,33.18 28.54,33.02 17.74,22.23 17.74,21.59 17.11,20.95 17.11,20.32 16.47,19.68 v16.47,17.14
N$11  (via drill 0.6)
  Top 0.406: U2.9 43.46,46.99 47.59,51.12 v47.59,51.44 47.59,53.08 D14.3 | D9.3 22.02,41.44 25.04,38.42 25.04,36.2 27.42,33.81 v27.42,33.18 | D4.3 6.28,18.76 6.63,18.41 12.98,18.41 v14.88,16.51
  Bottom 0.406: v47.59,51.44 47.59,51.12 44.41,47.94 44.41,44.45 38.7,38.73 32.98,38.73 27.58,33.34 27.58,33.02 v27.42,33.18 27.42,32.86 17.11,22.54 17.11,21.91 16.47,21.27 16.47,20.64 15.52,19.68 15.52,19.05 14.88,18.41 v14.88,16.51
N$12  (via drill 0.6)
  Top 0.406: U2.10 43,47.48 45.68,50.16 v45.68,50.99 46.17,51.48 D14.4 | D9.4 21.04,40.52 24.09,37.47 24.09,35.88 26,33.97 v26,33.18 | D4.4 8.74,17.57 v12.98,13.34
  Bottom 0.406: v45.68,50.99 45.68,50.48 43.46,48.26 43.46,44.77 38.06,39.37 32.66,39.37 27.58,34.29 27.11,34.29 v26,33.18 26,32.38 16.47,22.86 16.47,22.23 15.84,21.59 15.84,20.95 14.88,20 14.88,19.37 14.25,18.73 14.25,17.78 13.61,17.14 13.61,16.51 13.29,16.19 13.29,15.24 12.98,14.92 v12.98,13.34
N$13  (via drill 0.6)
  Top 0.406: D15.1 55.52,53.97 55.52,53.02 50.12,47.62 47.74,47.62 45.3,45.18 U2.5 45.24,45.12 43.62,43.5 43.62,42.55 v45.68,40.48 | v39.65,35.56 37.11,38.1 37.11,38.58 31.55,44.13 31.07,44.13 29.17,46.04 28.98,46.04 D10.1 | v33.61,31.75 26,31.75 24.09,29.84 18.38,29.84 14.25,25.72 10.12,25.72 9.8,26.04 9.43,26.04 D5.1
  Bottom 0.406: v45.68,40.48 45.68,40.16 44.57,39.05 44.09,39.05 41.23,36.2 39.33,36.2 | 39.33,36.2 36.47,36.2 34.57,34.29 34.57,32.7 v33.61,31.75 | v39.65,35.56 39.33,36.2
N$14  (via drill 0.6)
  Top 0.406: 53.04,53.72 D15.3 52.98,53.84 52.98,52.07 49.33,48.42 47.74,48.42 44.91,45.58 U2.6 44.84,45.51 42.51,43.18 42.51,42.18 v44.4,40.29 | D10.3 26.56,44.52 27.9,43.18 27.9,37.15 31.07,33.97 32.66,33.97 v33.3,33.34 | D5.3 8.39,23.95 10.12,22.23 14.56,22.23 16.79,20 18.06,20 v19.33,18.73
  Bottom 0.406: v44.4,40.29 44.22,40.45 40.6,36.83 35.84,36.83 33.3,34.29 v33.3,33.34 33.3,33.02 31.71,31.43 28.85,31.43 19.01,21.59 19.01,19.05 v19.33,18.73
N$15  (via drill 0.6)
  Top 0.406: U2.7 44.41,46.04 47.59,49.21 48.54,49.21 v51.08,51.75 51.71,52.39 51.71,53.77 D15.4 | D10.4 25.49,44 26.95,42.55 26.95,36.83 30.44,33.34 v30.44,32.86 | D5.4 7.62,22.82 9.48,20.95 14.25,20.95 16.47,18.73 17.11,18.73 v18.06,17.78
  Bottom 0.406: v51.08,51.75 49.49,50.16 49.17,50.16 46.31,47.31 46.31,43.81 39.97,37.47 35.36,37.47 31.07,33.18 v30.44,32.86 30.28,32.86 29.49,32.07 28.54,32.07 18.38,21.91 18.38,21.27 18.06,20.95 v18.06,17.78
N$16
  Top 0.305: C7.1 17.76,14.92 X2.2 18.69,14.61 18.85,14.61 19.96,13.5 U1.3
N$17
  Top 0.305: C11.1 X2.1 19.33,12.38 19.94,12.99 U1.4
N$18
  Top 0.406: U2.23 42.51,39.53 41.55,38.58 41.55,37.78 44.41,34.92 45.68,34.92 46.63,35.88 46.63,36.39 R2.2
N$19  (via drill 0.6)
  Top 0.305: U1.1 20.71,14.49 19.01,16.19 17.42,16.19 16.47,15.24 14.56,15.24 14.25,14.92 14.25,12.7 11.55,10 11.55,7.78 9.8,6.03 9.8,4.13 | 9.8,4.13 9.8,3.17 11.07,1.91 11.32,1.91 C2.1 | v8.85,4.13 9.8,4.13
  Bottom 0.305: D16.1 10.24,4.13 v8.85,4.13
N$20
  Top 0.305: U1.40 26.92,19.98 TP8.TP
N$21
  Top 0.305: U1.39 27.43,18.78 TP7.TP
N$22
  Top 0.305: SJ2.2 16.79,2.54 EP1.1
N$23
  Top 0.305: U1.20 26.44,6.54 26.63,6.35 26.63,6.03 TP6.TP
N$24
  Top 0.406: Q5.1 30.68,35.95 31.71,34.92 33.81,34.92 R5.1
N$25  (via drill 0.6)
  Top 0.305: U1.7 22.57,11.49 22.82,11.75 22.82,12.22 v23.14,12.22
  Bottom 0.305: v23.14,12.22 21.23,14.13 20.74,14.13 C12.1 TP3.TP
N$26
  Top 0.305: R3.1 19.17,20.8 | Q4.1
  Top 0.406: 19.17,20.8 18.69,21.27 17.74,21.27 16.79,22.23 Q4.1
N$27
  Bottom 0.406: 54.25,54.77 D15.2 54.25,53.9
  Bottom 0.61: 54.25,54.77 54.25,55.68 50.76,55.56 48.44,55.19 | D14.2 48.44,55.19 | D11.2 31.71,49.85 33.93,50.96 37.11,52.23 | 37.11,52.23 39.17,53.02 42.66,53.98 | 42.66,53.98 44.89,54.61 48.44,55.19 | 37.11,52.23 D12.2 | 42.66,53.98 D13.2 | 54.25,53.9 54.25,52.07 53.62,51.44 52.66,51.44 51.08,49.85 Q3.3
N$28
  Top 0.406: D10.2 27.67,45.63
  Top 0.61: 27.67,45.63 29.49,43.81 29.49,42.86 Q2.3
  Bottom 0.61: D10.2 26.47,46.99 24.09,45.4 21.87,43.66 | 17.57,39.82 15.52,37.78 13.59,35.55 | D6.2 10.12,30.8 11.23,32.54 13.59,35.55 | D7.2 13.59,35.55 | D8.2 17.57,39.82 | 21.87,43.66 19.17,41.43 17.57,39.82 | 21.87,43.66 21.87,43.51 D9.2
N$29
  Top 0.406: D5.2
  Top 0.61: D5.2 9.17,25.08 9.8,24.45 14.88,24.45 17.74,27.3 18.2,27.77 Q1.3
  Bottom 0.61: D5.2 7.26,26.04 5.67,22.86 4.72,20.48 | 1.55,9.21 D2.2 | D4.2 4.72,20.48 | D1.2 0.91,3.49 1.07,5.87 1.55,9.21 | 2.82,14.92 1.86,11.27 1.55,9.21 | 2.82,14.92 3.45,17.14 4.72,20.48 | 2.82,14.92 D3.2
N$30
  Top 0.406: U3.4 44.59,27.81 44.62,27.84 C8.1
N$31
  Top 0.305: U1.38 27.94,17.82 TP4.TP
N$33  (via drill 0.6)
  Top 0.305: U1.44 24.92,14.48 v24.41,13.97
  Bottom 0.305: v24.41,13.97 24.41,13.34 24.73,13.02 SJ1.2
N$34
  Bottom 0.406: 54.57,43.67 Q6.1 54.57,43.51 54.25,43.18 51.71,40.64 R7.1
N$40
  Top 0.305: U1.41 26.44,21.12 TP9.TP
N$41
  Top 0.305: U1.42 25.93,20.07 25.36,20.64 TP10.TP
N$42
  Top 0.305: U1.43 25.42,19.62 24.45,20.6 TP11.TP
N$43
  Top 0.305: U1.45 24.43,18.57 TP12.TP
N$44
  Top 0.305: U1.46 23.93,17.95 23.45,18.41 23.45,19.54 TP13.TP
P_A
  Top 0.406: Q4.3 18.5,25.67 Q1.1 19.65,24.23 R1.1
P_B
  Top 0.406: Q5.3 30.23,39.31 Q2.1 30.68,40.01 31.71,40.01 32.38,39.34 R4.1
P_C
  Bottom 0.406: R6.1 50.66,45.62 51.71,46.67 | 51.71,46.67 52.03,46.99 Q3.1 | Q6.3 52.52,45.87 51.71,46.67
RX
  Top 0.305: U1.31 31.65,12 32.03,12.38 TP2.TP
S_A  (via drill 0.6)
  Top 0.305: v34.57,6.35 33.61,5.4 28.54,5.4 27.43,6.5 U1.22 27.43,8.41 27.11,8.73 25.84,8.73 25.36,9.21 25.36,11.43 22.82,13.97 22.82,14.61 20.6,16.83 20.6,19.68 20.91,20 20.91,20.58 R3.2
  Bottom 0.305: v34.57,6.35 34.25,6.35 33.93,6.67
  Bottom 0.406: EP18.1 53.62,25.72 52.66,24.77 49.81,24.77 38.38,13.34 36.63,13.34 36.31,13.02 36.31,11.91 35.2,10.79 35.2,8.26 33.93,6.99 33.93,6.67 33.93,5.4 30.76,2.22 EP15.1
S_B  (via drill 0.6)
  Top 0.305: v36.79,10 36.79,9.84 35.52,8.57 30.44,8.57 30.01,9 U1.25
  Top 0.406: v39.65,31.43 45.36,31.43 v45.68,31.11 | v49.81,28.26 49.81,24.13 v52.66,21.27 | R5.2 35.39,33.78 35.68,33.81 v37.11,32.38
  Bottom 0.406: EP16.1 35.2,4.13 36.47,5.4 36.47,9.53 36.79,9.84 v36.79,10 36.95,10 48.22,21.27 v52.66,21.27 EP19.1 | v37.11,32.38 38.06,32.38 39.01,31.43 v39.65,31.43 | v45.68,31.11 45.68,29.21 46.63,28.26 v49.81,28.26
S_C  (via drill 0.6)
  Top 0.305: v37.27,12.38 34.09,9.21 31.39,9.21 31.11,9.49 U1.26
  Top 0.406: v51.4,28.26 51.4,25.4 53.3,23.5 EP17.1
  Bottom 0.406: R7.2 51.71,28.57 v51.4,28.26 | EP17.1 49.49,23.5 38.7,12.7 37.58,12.7 v37.27,12.38 37.27,11.91 35.84,10.48 35.84,6.03 32.98,3.17 EP20.1
SCK  (via drill 0.6)
  Top 0.305: U2.3 47.43,45.4 51.87,45.4 53.3,43.97 53.3,42.55 EP14.1 | U1.15 23.93,6.5 23.45,6.03 22.66,6.03 22.03,5.4 22.03,3.81 22.66,3.17 v22.98,3.17
  Top 0.406: U2.3
  Bottom 0.305: EP14.1 53.94,41.27 52.82,40.01 52.82,27.46 51.71,26.35 50.44,26.35 38.06,13.97 36.31,13.97 35.68,13.34 35.68,12.22 34.57,11.11 34.57,8.57 33.3,7.3 33.3,5.71 31.07,3.49 30.44,3.49 28.85,1.91 28.22,1.91 26.95,3.17 v22.98,3.17 16.47,3.17 EP3.1
SDO
  Top 0.305: EP2.1 53.94,39.05 52.66,37.78 49.81,37.78 46.16,34.13 44.09,34.13 40.6,37.62 40.6,38.58 U2.22
  Top 0.406: U2.22
SWCLK
  Top 0.305: U1.37 28.42,16.71 28.85,17.14 30.34,17.14 SW.4
SWDAT
  Top 0.305: U1.34 30.61,13.5 30.92,13.81 30.92,15.08 32.61,16.78 SW.2
TO1
  Top 0.305: U1.10 20.45,9.99 19.96,10.48 16.15,10.48 TSEN.4
TO2
  Top 0.305: U1.11 17.16,9.49 TSEN.6
TO3
  Top 0.305: U1.12 20.39,9 19.64,8.26 17.93,8.26 TSEN.5
TO4
  Top 0.305: U1.13 22.78,7.58 22.18,6.99 20.6,6.99 19.33,5.71 16.47,5.71 TSEN.3
TX
  Top 0.305: U1.30 31.65,11.49 TP1.TP

### Text on the board
_bsilk: ColourClock | __/__ | ME 220214